# EAGLE design pgacontrol (EAGLE 7.2.0)
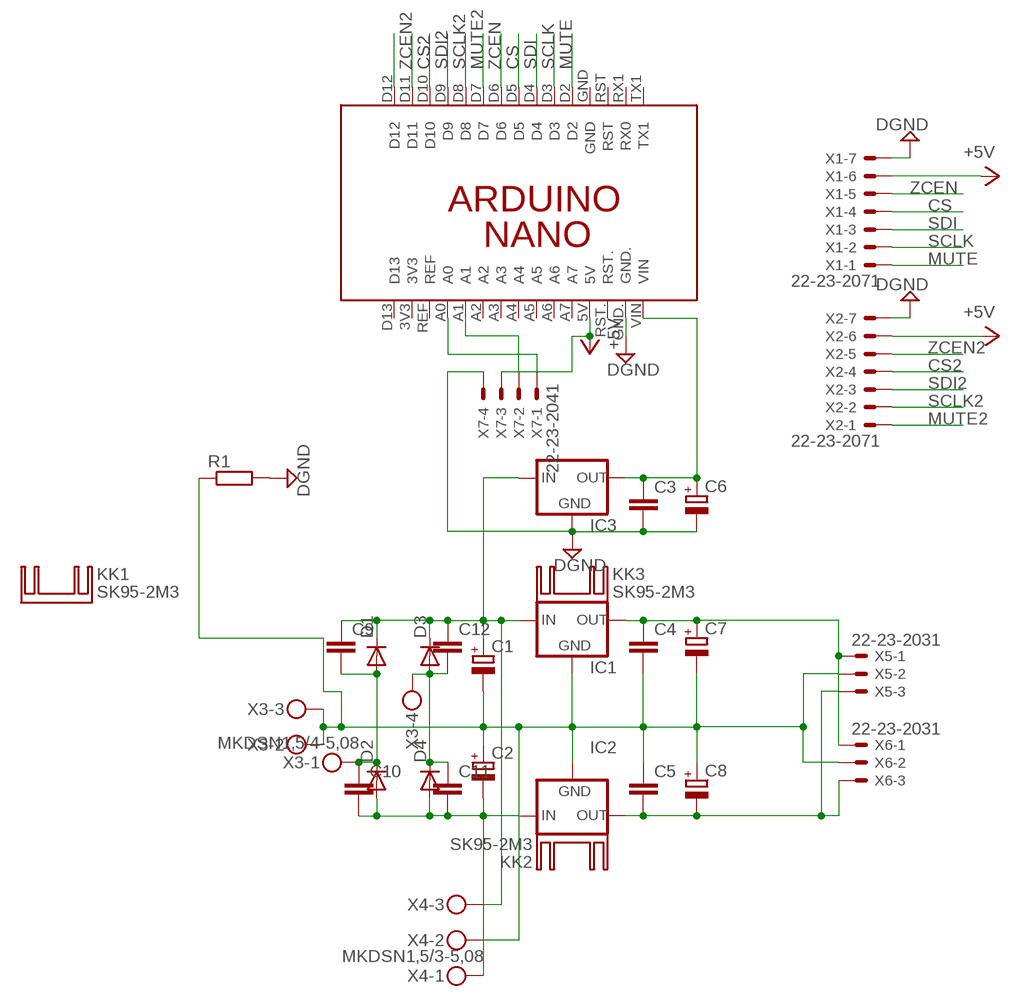
[diagram p0: schematic, sheet 1]

## Parts
C1  CPOL-EUE7.5-18  [E7,5-18]
C2  CPOL-EUE7.5-18  [E7,5-18]
C3  C-EU050-030X075  [C050-030X075]
C4  C-EU050-030X075  [C050-030X075]
C5  C-EU050-030X075  [C050-030X075]
C6  CPOL-EUE3.5-8  [E3,5-8]
C7  CPOL-EUE3.5-8  [E3,5-8]
C8  CPOL-EUE3.5-8  [E3,5-8]
C9  C-EU050-030X075  [C050-030X075]
C10  C-EU050-030X075  [C050-030X075]
C11  C-EU050-030X075  [C050-030X075]
C12  C-EU050-030X075  [C050-030X075]
D1  1N4148DO35-10  [DO35-10]
D2  1N4148DO35-10  [DO35-10]
D3  1N4148DO35-10  [DO35-10]
D4  1N4148DO35-10  [DO35-10]
IC1  78XXS  [78XXS]
IC2  79XXS  [79XXS]
IC3  78XXS  [78XXS]
KK1  SK95-2M3  [SK95-2M3]
KK2  SK95-2M3  [SK95-2M3]
KK3  SK95-2M3  [SK95-2M3]
PCB1  ARDUINO_NANO  [ARDUINO_NANO]
R1  R-EU_0207/7  [0207/7]
X1  22-23-2071  [22-23-2071]
X2  22-23-2071  [22-23-2071]
X3  MKDSN1,5/4-5,08  [MKDSN1,5/4-5,08]
X4  MKDSN1,5/3-5,08  [MKDSN1,5/3-5,08]
X5  22-23-2031  [22-23-2031]
X6  22-23-2031  [22-23-2031]
X7  22-23-2041  [22-23-2041]

## Nets
+5V: PCB1.5V X1.6 X2.6 X7.3
+15: C4.1 C7.+ IC1.OUT X5.1 X6.1
CS: PCB1.D5 X1.4
CS2: PCB1.D10 X2.4
DGND: C3.2 C6.- IC3.GND PCB1.GND. R1.2 X1.7 X2.7 X7.4
GND: C1.- C2.+ C4.2 C5.1 C7.- C8.+ IC1.GND IC2.GND R1.1 X3.2 X3.3 X4.2 X5.2 X6.2
MUTE: PCB1.D2 X1.1
MUTE2: PCB1.D7 X2.1
N$1: C9.2 C10.1 D1.A D2.C X3.1
N$2: PCB1.A0 X7.1
N$3: C11.1 C12.2 D3.A D4.C X3.4
N$4: PCB1.A1 X7.2
N$7: C5.2 C8.- IC2.OUT X5.3 X6.3
N$9: C3.1 C6.+ IC3.OUT PCB1.VIN
N$10: PCB1.D12
SCLK: PCB1.D3 X1.2
SCLK2: PCB1.D8 X2.2
SDI: PCB1.D4 X1.3
SDI2: PCB1.D9 X2.3
V+: C1.+ C9.1 C12.1 D1.C D3.C IC1.IN IC3.IN X4.3
V-: C2.- C10.2 C11.2 D2.A D4.A IC2.IN X4.1
ZCEN: PCB1.D6 X1.5
ZCEN2: PCB1.D11 X2.5
Unconnected: PCB1.3V3 PCB1.A2 PCB1.A3 PCB1.A4 PCB1.A5 PCB1.A6 PCB1.A7 PCB1.D13 PCB1.GND PCB1.REF PCB1.RST PCB1.RST. PCB1.RX1(RX0) PCB1.TX1

## Library data of the parts
C1 C2 C6-C8 = Vwvwbg:CPOL-EU: POLARIZED CAPACITOR, European symbol
C3-C5 C9-C12 = Vwvwbg:C-EU: CAPACITOR, European symbol
D1-D4 = diode:1N4148: DIODE high speed (Philips)
IC1 IC3 = v-reg:78XXS: VOLTAGE REGULATOR
IC2 = v-reg:79XXS: VOLTAGE REGULATOR
KK1-KK3 = heatsink:SK95-2M3: HEATSINK manufacturer Fischer/distributor Buerklin
PCB1 = E14_Arduino_revB:ARDUINO_NANO: Device for representing an Arduino Nano board with a footprint in an EAGLE design. Created by Dave Young for Element14. More EAGLE documentation at: http://www.element14.com/community/community/knode/cadsoft_eagle
R1 = Vwvwbg:R-EU_: RESISTOR, European symbol
X1 X2 = con-molex:22-23-2071: .100" (2.54mm) Center Header - 7 Pin; MF: MOLEX; MPN: 22-23-2071; OC_FARNELL: 1654534; OC_NEWARK: 56H0445
X3 = con-phoenix-508:MKDSN1,5/4-5,08: MKDSN 1,5/ 4-5,08 Printklemme Nennstrom: 13,5 A Nennspannung: 250 V Rastermaß: 5,08 mm Polzahl: 4 Anschlussart: Schraubanschluss Montage: Löten Anschlussrichtung Leiter/Platine: 0 ° Artikelnummer: 1729144 Source: http://eshop.phoenixcontact.com .. 1729144.pdf
X4 = con-phoenix-508:MKDSN1,5/3-5,08: MKDSN 1,5/ 3-5,08 Printklemme Nennstrom: 13,5 A Nennspannung: 250 V Rastermaß: 5,08 mm Polzahl: 3 Anschlussart: Schraubanschluss Montage: Löten Anschlussrichtung Leiter/Platine: 0 ° Artikelnummer: 1729131 Source: http://eshop.phoenixcontact.com .. 1729131.pdf
X5 X6 = con-molex:22-23-2031: .100" (2.54mm) Center Header - 3 Pin; MF: MOLEX; MPN: 22-23-2031; OC_FARNELL: 1462950; OC_NEWARK: 30C0862
X7 = con-molex:22-23-2041: .100" (2.54mm) Center Header - 4 Pin; MF: MOLEX; MPN: 22-23-2041; OC_FARNELL: 1462920; OC_NEWARK: 38C0355

## Board
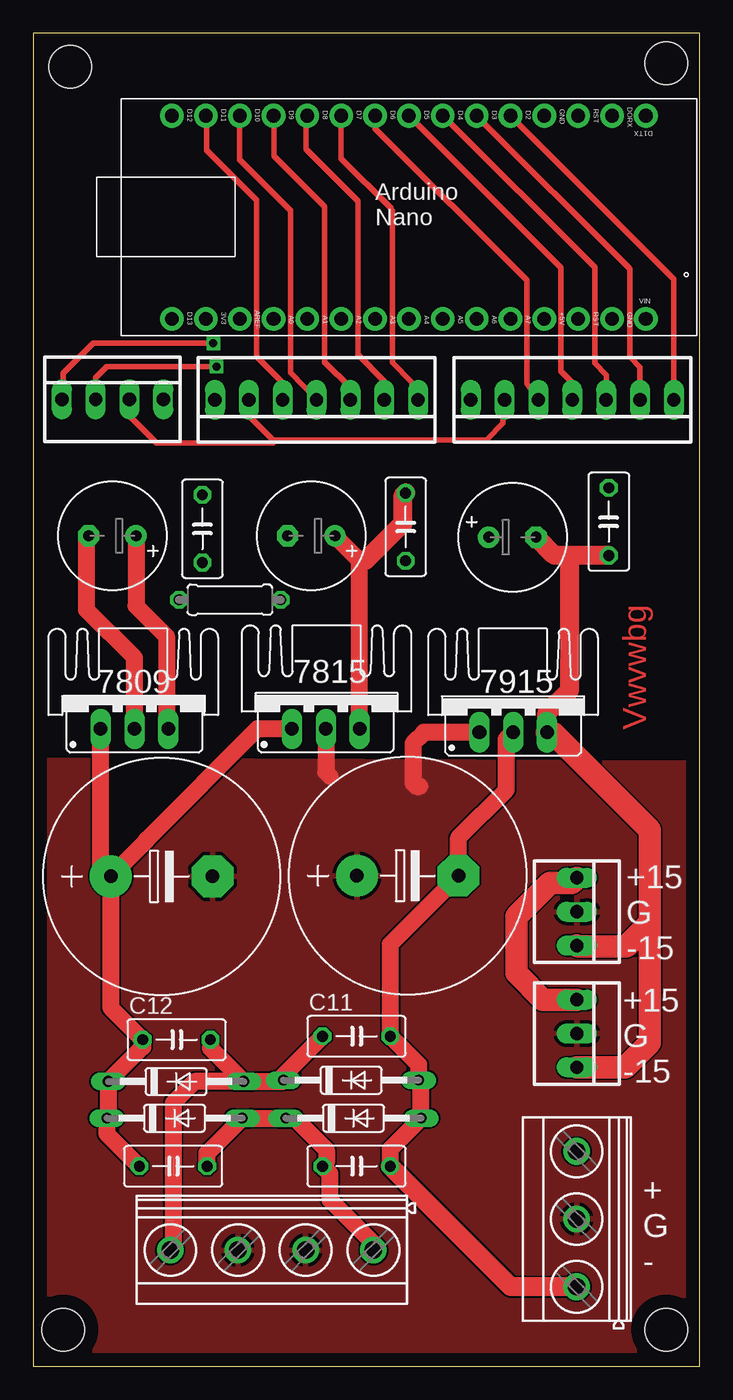
[diagram p1: board, top side]
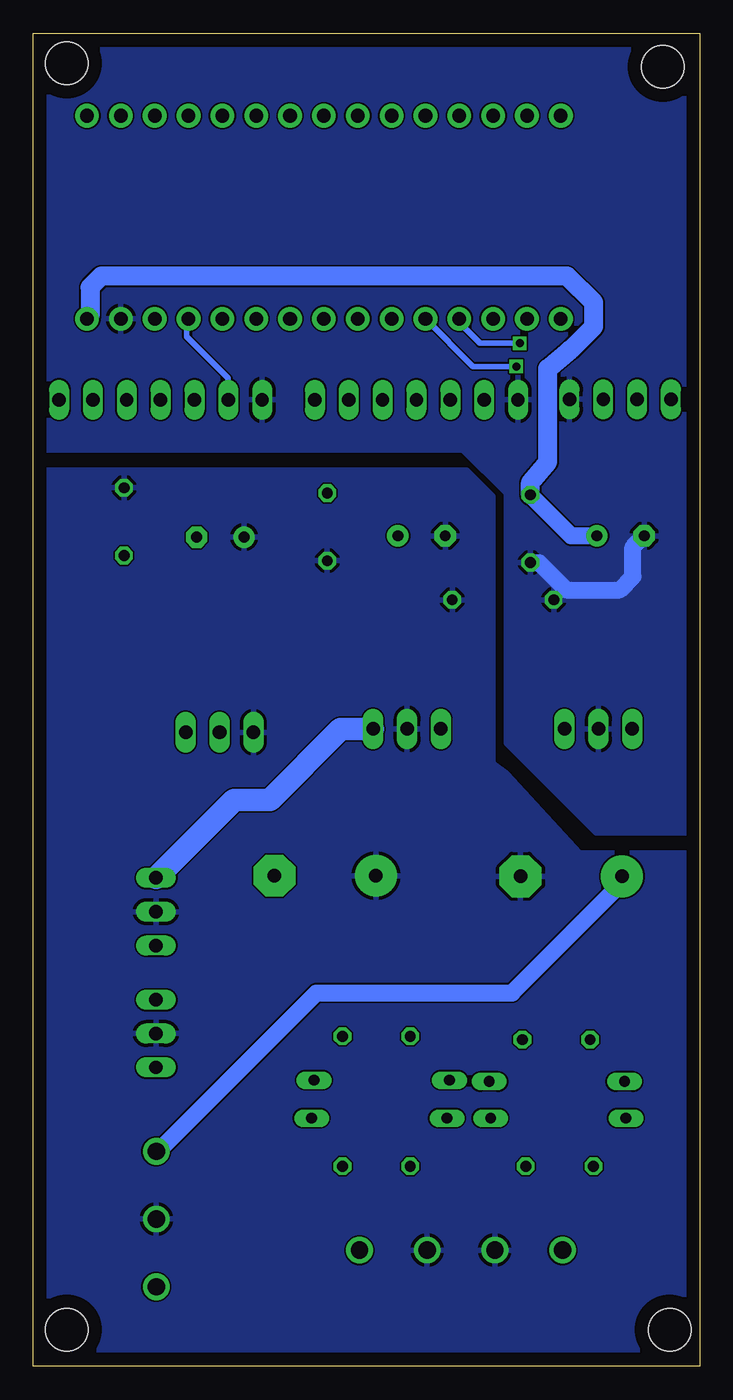
[diagram p2: board, bottom side, seen from below]

Size 50 x 100 mm. Coordinates in mm from the lower left corner, seen from the top.
Outline: 0,0 50,0 50,100 0,100 0,0
Copper layers (1*16): Top 0.035mm / dielectric 1.5mm / Bottom 0.035mm
Design rules "default *": minimum track width 10mil, minimum drill 12mil, track to track 5mil, track to pad 5mil, pad to pad 5mil, via to via 5mil, smd to smd 5mil, copper to edge 40mil, drill to drill 8mil, minimum pad ring 10mil, minimum via ring 8mil, stop-mask expansion 4mil, vias tented up to drill 0mil, thermal gap 10mil
Holes 3.2 mm at 2.25,2.75 47.5,2.75 47.5,97.75 2.75,97.5

### Footprints (pad centres in the part's own frame; a part is rotated, then mirrored left to right if it is on the bottom)
E7,5-18 = drill 1.016 pad 3.15: + -3.81,0 | drill 1.016 pad 3.15 octagon: - 3.81,0
C050-030X075 = drill 0.813 octagon: 1 -2.54,0; 2 2.54,0
E3,5-8 = drill 0.813 pad 1.6: + -1.778,0 | drill 0.813 pad 1.6 octagon: - 1.778,0
DO35-10 = drill 0.813 long: A 5.08,0; C -5.08,0
78XXS = drill 1.016 long: GND 0,-2.54; IN -2.54,-2.54; OUT 2.54,-2.54
79XXS = drill 1.016 long: GND -2.54,-2.54; IN 0,-2.54; OUT 2.54,-2.54
ARDUINO_NANO = drill 1.016 pad 1.778: 3V3 6.35,1.27; 5V 31.75,1.27; A0 11.43,1.27; A1 13.97,1.27; A2 16.51,1.27; A3 19.05,1.27; A4 21.59,1.27; A5 24.13,1.27; A6 26.67,1.27; A7 29.21,1.27; D2 29.21,16.51; D3 26.67,16.51; D4 24.13,16.51; D5 21.59,16.51; D6 19.05,16.51; D7 16.51,16.51; D8 13.97,16.51; D9 11.43,16.51; D10 8.89,16.51; D11 6.35,16.51; D12 3.81,16.51; D13 3.81,1.27; GND 31.75,16.51; GND. 36.83,1.27; REF 8.89,1.27; RST 34.29,16.51; RST. 34.29,1.27; RX1 36.83,16.51; TX1 39.37,16.51; VIN 39.37,1.27
0207/7 = drill 0.813 octagon: 1 -3.81,0; 2 3.81,0
22-23-2071 = drill 1 long: 1 -7.62,0; 2 -5.08,0; 3 -2.54,0; 4 0,0; 5 2.54,0; 6 5.08,0; 7 7.62,0
MKDSN1,5/4-5,08 = drill 1.3 pad 2: 1 -7.641,0.025; 2 -2.561,0.025; 3 2.519,0.025; 4 7.599,0.025
MKDSN1,5/3-5,08 = drill 1.3 pad 2: 1 -7.641,0.025; 2 -2.561,0.025; 3 2.519,0.025
22-23-2031 = drill 1 long: 1 -2.54,0; 2 0,0; 3 2.54,0
22-23-2041 = drill 1 long: 1 -3.81,0; 2 -1.27,0; 3 1.27,0; 4 3.81,0

### Placement (x,y rotation side)
C1  9.63,36.75 0 top
C2  28.1,36.8 0 top
C3  12.69,62.83 270 top
C4  27.94,62.97 270 top
C5  43.19,63.36 270 top
C6  5.93,62.3 180 top
C7  20.86,62.3 180 top
C8  35.96,62.2 0 top
C9  10.5,15 0 top
C10  24.25,15 0 top
C11  24.25,24.75 0 top
C12  10.75,24.5 0 top
D1  10.6,18.61 0 top
D2  24.03,18.61 0 top
D3  10.71,21.36 0 top
D4  23.85,21.46 0 top
IC1  21.95,50.35 0 top
IC2  36.02,50.1 0 top
IC3  7.59,50.35 0 top
KK1  7.5,50.25 0 top
KK2  22,50.5 0 top
KK3  36,50.25 0 top
PCB1  6.6,77.31 0 top
R1  14.75,57.5 180 top
X1  40.45,72.51 180 top
X2  21.25,72.51 180 top
X3  17.88,8.73 180 top
X4  40.8,13.6 90 top
X5  40.79,24.96 270 top
X6  40.79,34.1 270 top
X7  5.95,72.54 0 top

### Tracks (layer width: path | path; a pad name or v marks a point on that pad's centre or on a via)
+5V
  Top 0.406: X2.6 16.17,71.33 18,69.5 18.25,69.5 | 18.25,69.5 34,69.5 35.25,70.75 35.25,72.39 X1.6 | X7.3 7.22,71.28 9.25,69.25 18,69.25 18.25,69.5
  Bottom 0.406: X1.6 35.37,74.12 38.5,77.25 38.5,78.43 PCB1.5V
+15
  Top 1.27: IC1.OUT 24.49,60.45 C7.+
  Top 1.422: 24.49,60.45 24.95,60.45 27.75,63.25 27.75,65.32 C4.1
  Top 1.676: X5.1 38.25,27.5 36.25,29.5 36.25,33.75 38.75,36.25 40.4,36.25 X6.1
  Bottom 1.676: IC1.OUT 26.94,47.81 32.25,42.5 34.93,42.5 X6.1
CS
  Top 0.406: X1.4 40.45,73.8 39.6,74.65 39.6,82.41 PCB1.D5
CS2
  Top 0.406: PCB1.D10 15.49,90.51 19.25,86.75 19.25,86.7 19.3,86.75 19.3,74.56 X2.4
DGND
  Top 1.27: 7.5,47.72 IC3.GND 7.59,53.16 4,56.75 4,62.15 C6.-
  Bottom 1.27: C3.2 12.04,60.29 10,58.25 6,58.25 5,59.25 5,61.45 C6.-
  pour Bottom: 0,40 7.75,40 14.5,46.75 14.5,65.5 17.75,68.75 50,68.75 50,100.25 0,100.25 -0.25,100
GND
  Top 1.27: IC2.GND 29.31,47.56 28.5,46.75 28.5,43.75 28.75,43.5 29,43.5 | IC1.GND 21.95,44.55 22.25,44.25
  pour Top: 49.75,45.25 49.75,0 0,0 0,45.5
  pour Bottom: -0.5,38.5 9,38.5 14.5,44.5 15.5,45.25 15.5,65.25 17.5,67.25 50,67.25 50,0 50.25,-0.25 -0.25,-0.25
MUTE
  Top 0.406: X1.1 48.07,81.56 PCB1.D2
MUTE2
  Top 0.406: PCB1.D7 23.11,90.59 26.8,86.9 26.85,86.9 26.95,86.7 26.95,75.3 28.4,73.8 28.4,72.98 X2.1
N$1
  Top 1.27: X3.1 25.52,9.23 22.25,12.5 22.25,14.46 C10.1 22,15.29 22,16.25 19.64,18.61 D2.C D1.A 13.04,15.97 C9.2
N$2  (via drill 0.6)
  Top 0.406: v13.5,76.75 4.5,76.75 2.25,74.5 2.25,72.65 X7.1
  Bottom 0.406: PCB1.A0 18.03,78.28 16.5,76.75 v13.5,76.75
N$3
  Top 1.27: C12.2 13.29,23.86 D3.A | D3.A 18.67,21.36 D4.C 18.77,21.81 C11.1 | D3.A 12.11,21.36 10.5,19.75 10.5,8.92 X3.4
N$4  (via drill 0.6)
  Top 0.406: X7.2 4.68,74.18 5.5,75 v13.75,75
  Bottom 0.406: v13.75,75 16.99,75 PCB1.A1
N$7
  Top 1.422: C5.2 40.5,60.82 | 40.5,60.82 39.12,60.82 C8.- | IC2.OUT 38.56,49.06 40.25,50.75 40.25,60.57 40.5,60.82
  Top 1.676: IC2.OUT 38.94,47.56 46.25,40.25 46.25,33.25 | 46.25,33.25 44.5,31.5 40.85,31.5 X6.3 | X5.3 44.42,22.42 46.25,24.25 46.25,33.25
N$9
  Top 1.27: C6.+ 7.71,57.04 10,54.75 10,47.94 IC3.OUT
  Bottom 1.27: C6.+ 9.62,62.3 C3.1
  Bottom 1.422: C3.1 12.69,66.31 11.4,67.85 11.4,74.85 9.75,76.25 9.7,76.25 7.95,78 7.95,79.8 9.95,81.8 44.9,81.8 45.75,80.95 45.75,78.8 PCB1.VIN
SCLK
  Top 0.406: X1.2 45.53,74.97 44.75,75.75 44.75,82.34 PCB1.D3
SCLK2
  Top 0.406: X2.2 26.33,73.92 24.35,75.9 24.35,87.4 20.45,91.3 20.45,93.7 PCB1.D8
SDI
  Top 0.406: X1.3 42.99,74.36 42.15,75.25 42.15,82.45 PCB1.D4
SDI2
  Top 0.406: X2.3 23.79,73.41 21.85,75.35 21.85,87 18.05,90.8 18.05,93.8 PCB1.D9
V+
  Top 1.27: C1.+ 5.05,36.75 IC3.IN | IC1.IN 16.81,47.81 8.5,39.5 8.5,39.43 C1.+ | C1.+ 5.82,26.89 C12.1 8.21,23.94 D3.C 5.63,18.72 D1.C 5.52,17.44 C9.1
  Bottom 1.27: X4.3 40.63,16.12 28.75,28 14.07,28 5.82,36.25 C1.+
V-
  Top 1.27: C10.2 26.79,16.29 D2.A 29.11,21.28 D4.A 28.93,22.61 C11.2 26.79,31.68 C2.- 31.91,39.66 35.5,43.25 35.5,47.04 IC2.IN
  Top 1.422: X4.1 35.83,5.96 C10.2
ZCEN
  Top 0.406: PCB1.D6 25.65,92.85 37.05,81.5 37.05,73.72 X1.5
ZCEN2
  Top 0.406: X2.5 18.71,73.79 16.75,75.75 16.75,87.5 13,91.25 13,93.77 PCB1.D11

### Text on the board
Top: Vwvwbg
tPlace: 7815 | 7809 | 7915 | +15 / G / -15 | +15 / G / -15 | + / G / -